# EAGLE design 229_pedometer (EAGLE 9.6.2)
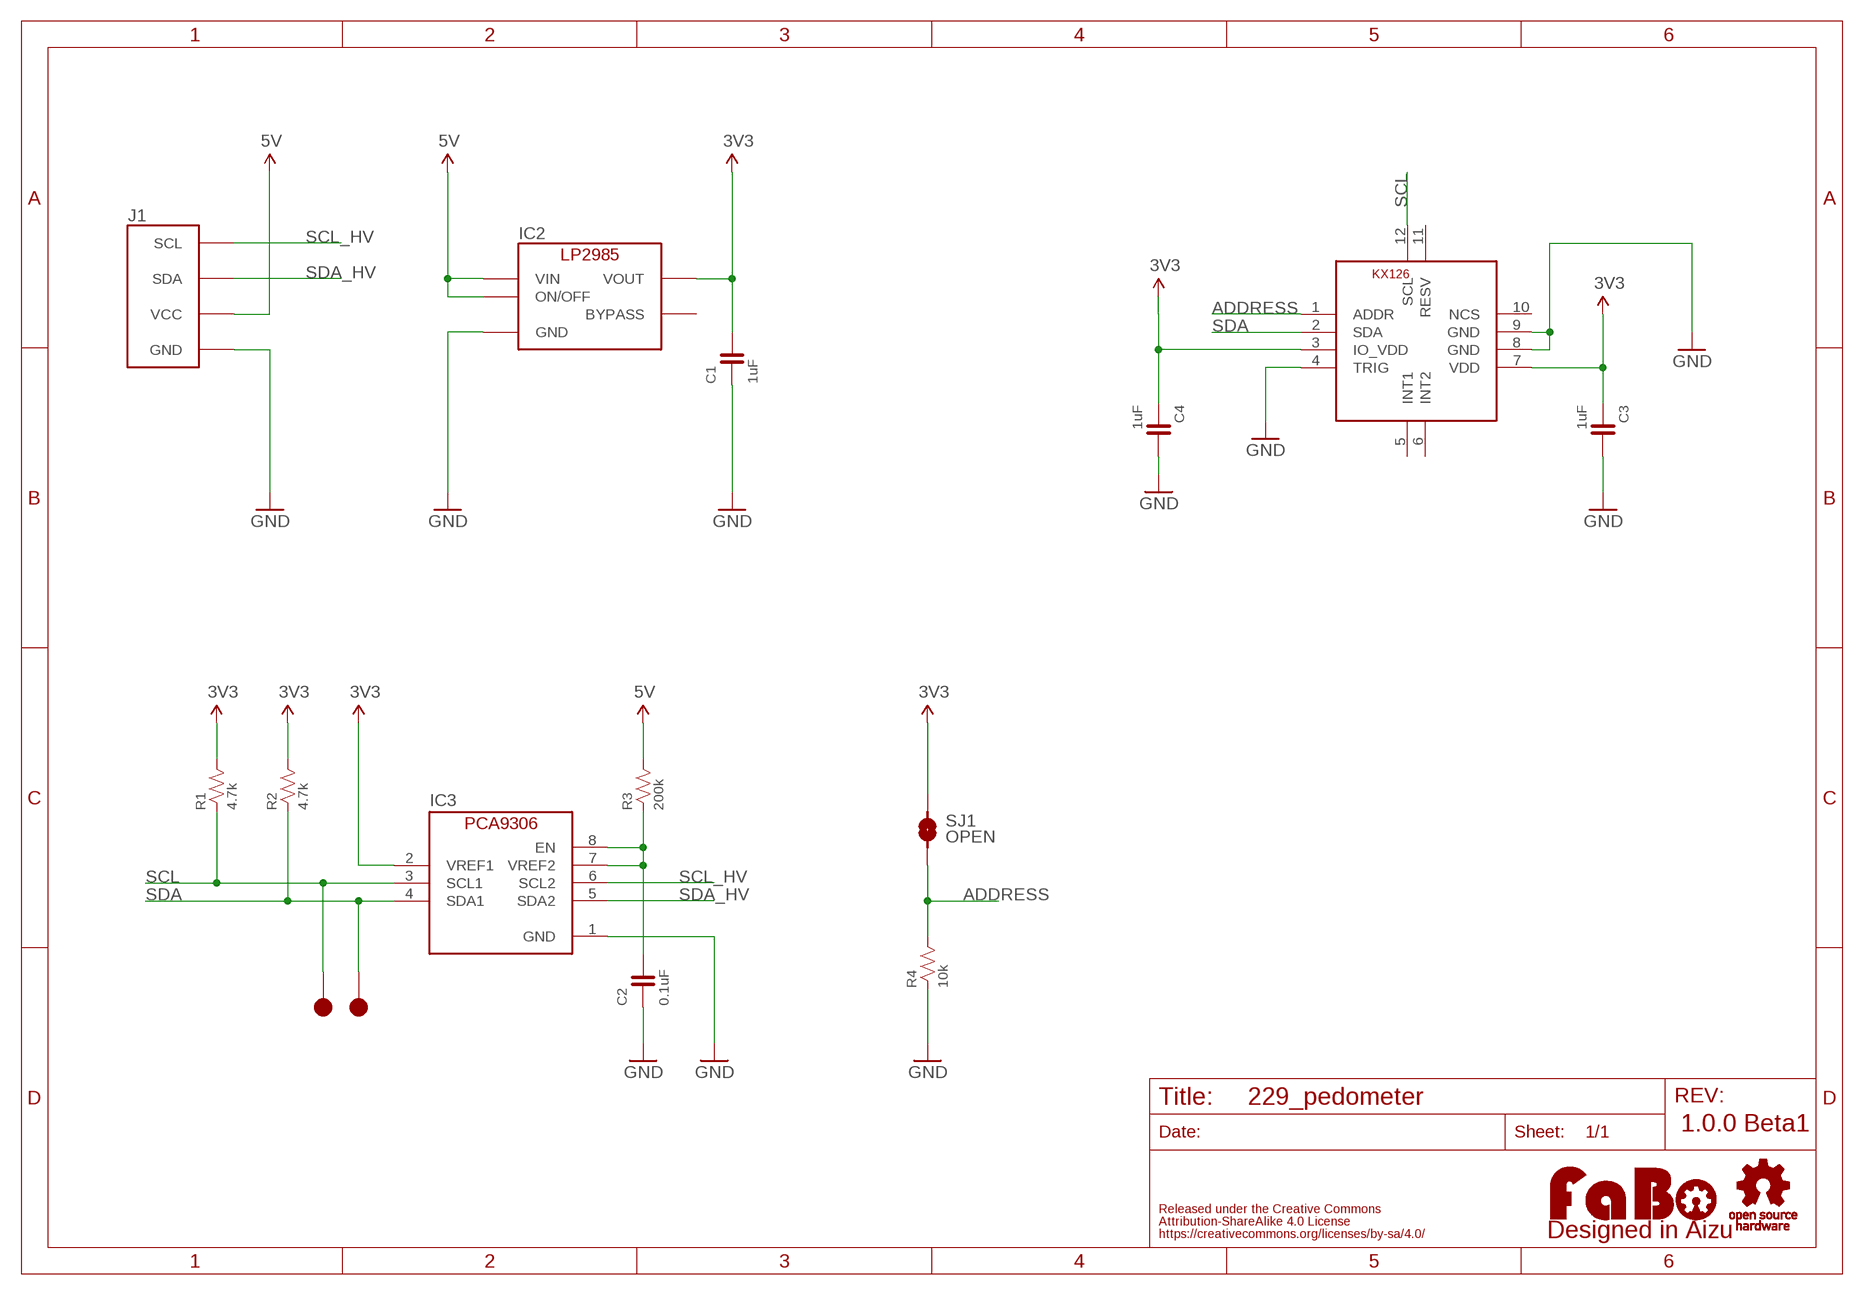
[diagram p0: schematic, sheet 1]

## Parts
C1  1uF  CAPACITOR-0603  [0603]
C2  0.1uF  CAPACITOR-0603  [0603]
C3  1uF  CAPACITOR-0603  [0603]
C4  1uF  CAPACITOR-0603  [0603]
IC2  LP2985-33DBV  [SOT-23-5]
IC3  PCA9306GM  [XQFN8]
J1  FABO_BRICK_I2C  [FABO_BRICK_I2C]
LOGO1  LOGO_FABO-M  [LOGO_FABO_M]
R1  4.7k  RESISTOR-0603  [0603]
R2  4.7k  RESISTOR-0603  [0603]
R3  200k  RESISTOR-0603  [0603]
R4  10k  RESISTOR-0603  [0603]
SJ1  OPEN  SMD-JUMPER-2  [SMD-JUMPER-2]
TP1  TP-15  [TP-15]
TP2  TP-15  [TP-15]
U$2  LOGO_OSHW-M_BOTTOM  [LOGO_OSHW_M_BOTTOM]
U$4  KX-KX126  [KIONIX-KX126]

## Nets
3V3: C1.2 C3.1 C4.1 IC2.5(VOUT) IC3.2(VREF1) R1.2 R2.2 SJ1.1 U$4.3(IO_VDD) U$4.7(VDD)
5V: IC2.1(VIN) IC2.3(ON/OFF) J1.VCC R3.2
ADDRESS: R4.2 SJ1.2 U$4.1(ADDR)
GND: C1.1 C2.1 C3.2 C4.2 IC2.2(GND) IC3.1(GND) J1.GND R4.1 U$4.4(TRIG) U$4.8(GND) U$4.9(GND)
N$1: C2.2 IC3.7(VREF2) IC3.8(EN) R3.1
SCL: IC3.3(SCL1) R1.1 TP2.1 U$4.12(SCL)
SCL_HV: IC3.6(SCL2) J1.SCL
SDA: IC3.4(SDA1) R2.1 TP1.1 U$4.2(SDA)
SDA_HV: IC3.5(SDA2) J1.SDA
Unconnected: IC2.4(BYPASS) U$4.5(INT1) U$4.6(INT2) U$4.10(NCS) U$4.11(RESV)

## Notes on the sheet
- 1.0.0 Beta1

## Library data of the parts
C1-C4 = FaBo-Capacitor:CAPACITOR: CAPACITOR
IC2 = FaBo-Supply:LP2985: LP2985
IC3 = FaBo-LevelTranslator:PCA9306
J1 = FaBo-Template:FABO_BRICK_I2C: FaBo Brick I2C
LOGO1 = component:LOGO_FABO
R1-R4 = FaBo-Resistors:RESISTOR: RESISTOR
SJ1 = FaBo-etc:SMD-JUMPER-2
TP1 TP2 = FaBo-Supply:TP
U$2 = FaBo-etc:LOGO_OSHW
U$4 = FaBo-Mems:KX-KX126

## Board
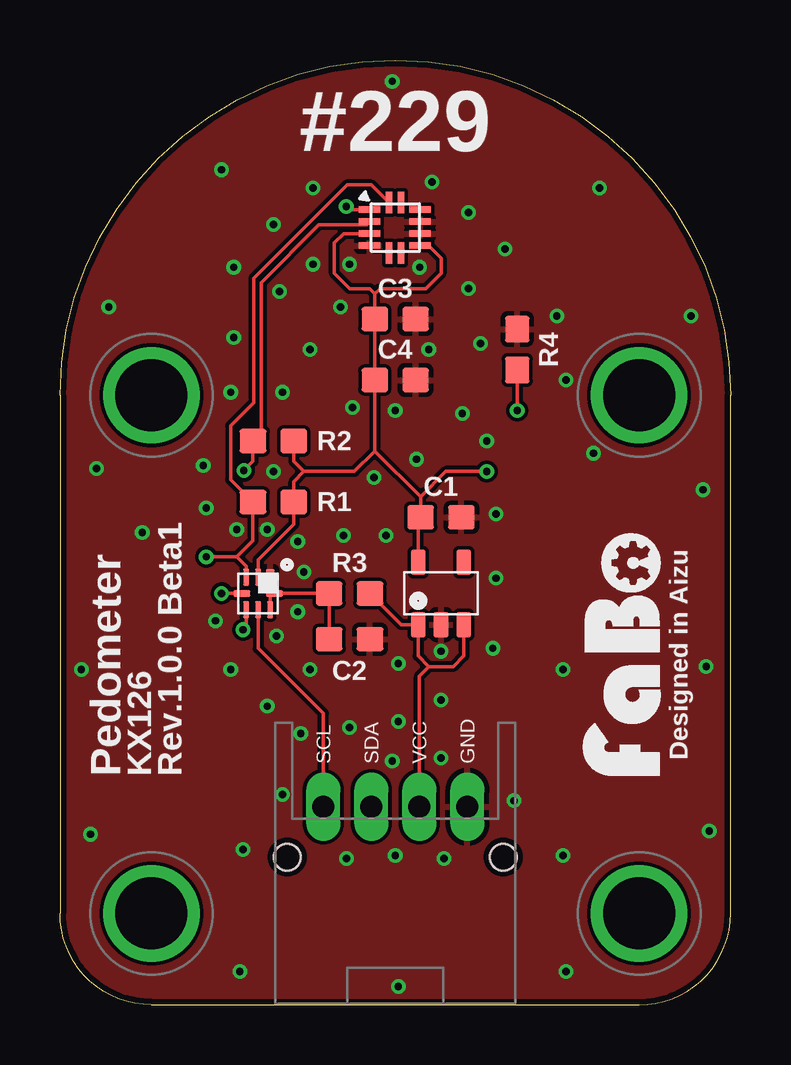
[diagram p1: board, top side]
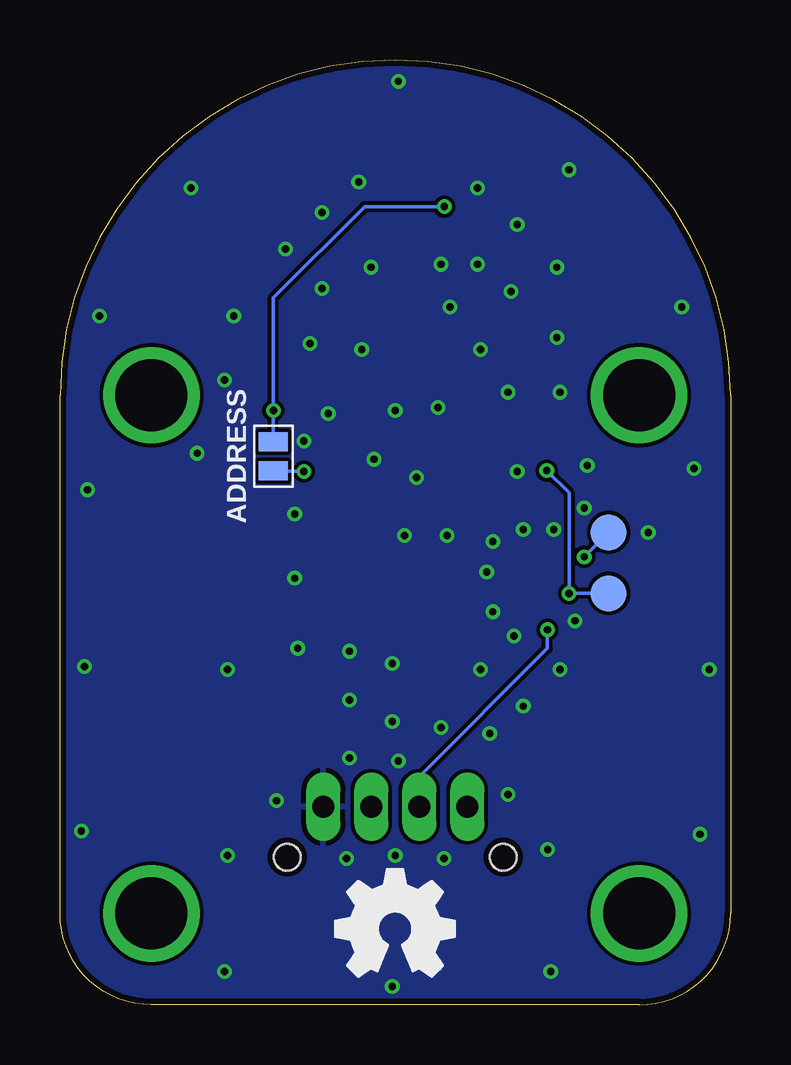
[diagram p2: board, bottom side, seen from below]

Size 27.94 x 39.37 mm. Coordinates in mm from the lower left corner, seen from the top.
Copper layers (1*16): Top 0.035mm / dielectric 1.6mm / Bottom 0.035mm
Design rules "PCBway": minimum track width 6mil, minimum drill 12mil, track to track 6mil, track to pad 6mil, pad to pad 6mil, via to via 6mil, smd to smd 6mil, copper to edge 10mil, drill to drill 10mil, minimum pad ring 10mil, minimum via ring 6mil, stop-mask expansion 2mil, vias tented up to drill 100mil, thermal gap 8mil

### Footprints (pad centres in the part's own frame; a part is rotated, then mirrored left to right if it is on the bottom)
0603 = smd 1.1 x 1: 1 -0.85,0; 2 0.85,0
SOT-23-5 = smd 0.6 x 1.05: 1 -0.95,-1.3; 2 0,-1.3; 3 0.95,-1.3; 4 0.95,1.3; 5 -0.95,1.3
XQFN8 = smd 0.7 x 0.35: 1 -0.675,0.5 | smd 0.7 x 0.25: 2 -0.675,0; 3 -0.675,-0.5; 5 0.675,-0.5; 6 0.675,0; 7 0.675,0.5 | smd 0.25 x 0.7: 4 0,-0.675; 8 0,0.675
FABO_BRICK_I2C = drill 0.9 pad 1.422 long: GND 3,-10.795; SCL -3,-10.795; SDA -1,-10.795; VCC 1,-10.795 | drill 3 pad 3.81: P$1 -10.16,6.35; P$2 10.16,6.35; P$3 -10.16,-15.24; P$4 10.16,-15.24 | hole 1.1: -4.5,-12.895; 4.5,-12.895
SMD-JUMPER-2 = smd 0.8 x 1.2: 1 -0.6,0; 2 0.6,0
TP-15 = smd 1.5 x 1.5: 1 0,0
KIONIX-KX126 = smd 0.9 x 0.27: 1 -1.07,0.75; 2 -1.07,0.25; 3 -1.07,-0.25; 4 -1.07,-0.75; 7 1.03,-0.75; 8 1.03,-0.25; 9 1.03,0.25; 10 1.03,0.75 | smd 0.27 x 0.9: 5 -0.27,-1.05; 6 0.23,-1.05; 11 0.23,1.05; 12 -0.27,1.05

### Placement (x,y rotation side)
C1  15.88,20.32 180 top
C2  12.06,15.24 180 top
C3  13.97,28.57 0 top
C4  13.97,26.04 0 top
IC2  15.88,17.14 0 top
IC3  8.26,17.14 270 top
J1  13.97,19.05 0 top
LOGO1  25.4,14.61 90 top
R1  8.89,20.95 0 top
R2  8.89,23.5 0 top
R3  12.06,17.14 0 top
R4  19.05,27.3 270 top
SJ1  19.05,22.86 90 bottom
TP1  5.08,17.14 0 bottom
TP2  5.08,19.68 0 bottom
U$2  13.97,3.17 0 top
U$4  13.97,32.38 0 top

### Tracks (layer width: path | path; a pad name or v marks a point on that pad's centre or on a via)
3V3  (via drill 0.3)
  Top 0.152: IC2.5 14.93,20.22 C1.2 15.03,21.17 | 13.12,23.07 C4.1 C3.1 13.12,29.63 | 13.12,23.07 15.03,21.17 | v17.78,22.23 16.08,22.23 15.03,21.17 | 10.16,22.23 12.27,22.23 13.12,23.07 | 13.12,29.63 13.34,29.84 15.24,29.84 15.88,30.48 15.88,31.11 15.36,31.64 U$4.7 | U$4.3 11.81,32.13 11.43,31.75 11.43,30.48 12.06,29.84 12.9,29.84 13.12,29.63 | R2.2 9.74,22.64 10.16,22.23 | 10.16,22.23 9.74,21.8 R1.2 9.74,20.03 8.26,18.54 IC3.2
  Bottom 0.152: SJ1.1 19.02,22.23 v17.78,22.23
5V
  Top 0.152: 15.37,14.1 14.93,14.54 IC2.1 14.21,15.85 R3.2 | IC2.3 16.82,14.54 16.38,14.1 15.37,14.1 | J1.VCC 14.97,13.7 15.37,14.1
ADDRESS  (via drill 0.3)
  Top 0.152: R4.2 v19.05,24.77 | U$4.1 12.05,33.13 v11.93,33.26
  Bottom 0.152: SJ1.2 v19.05,24.77 19.05,29.46 15.25,33.26 v11.93,33.26
GND  (via drill 0.3)
  other vias: 10.54,30.86 12.06,30.86 8.89,22.23 8.64,19.81 7.37,19.81 6.1,20.7 9.91,19.3 10.16,18.03 13.08,21.97 13.59,19.56 9.91,16.38 9.02,15.37 6.48,16 3.43,19.68 5.97,22.48 7.11,25.53 9.27,25.53 12.19,24.89 13.97,24.77 14.86,22.73 17.78,23.5 18.16,20.45 18.16,17.78 18.03,14.86 15.88,14.73 14.1,14.22 11.81,19.56 14.1,11.81 15.88,12.7 15.88,10.29 13.84,10.16 12.06,11.56 10.03,11.3 9.27,8.76 18.92,8.51 11.94,6.1 16,6.1 13.97,6.22 7.11,13.97 8.64,12.45 10.41,13.97 9.14,29.72 7.24,30.73 8.89,32.51 10.54,34.04 14.99,30.73 11.68,29.08 10.41,27.3 15.37,27.3 17.02,29.84 16.76,24.64 17.53,27.56 18.54,31.5 15.49,34.29 17.02,33.02 20.7,28.7 21.08,26.04 22.23,22.99 7.24,27.81 7.62,6.48 20.95,6.22 21.08,1.4 7.49,1.4 14.1,0.76 27.05,7.24 1.27,7.11 26.8,21.46 26.92,14.1 20.95,13.97 0.89,13.97 1.52,22.35 26.29,28.7 2.03,29.08 6.73,34.8 22.48,34.04 13.84,38.48
  pour Top (isolate 0.152): 0,0 27.94,0 27.94,39.37 0,39.37
  pour Bottom (isolate 0.152): 0,0 27.94,0 27.94,39.37 0,39.37
N$1
  Top 0.152: C2.2 R3.1 IC3.8 8.76,17.14 IC3.7
SCL  (via drill 0.3)
  Top 0.152: U$4.12 12.97,34.16 11.96,34.16 8.08,30.28 8.08,25.09 7.11,24.13 7.11,21.88 R1.1 8.04,19.34 7.37,18.67 | 7.37,18.67 v6.1,18.67 | IC3.3 7.75,18.28 7.37,18.67
  Bottom 0.152: TP2.1 v6.1,18.67
SCL_HV
  Top 0.152: IC3.6 8.26,14.86 10.97,12.14 J1.SCL
SDA  (via drill 0.3)
  Top 0.152: U$4.2 12.77,32.51 10.79,32.51 8.38,30.1 8.38,23.84 R2.1 8.04,22.64 v7.66,22.26 | IC3.4 v6.73,17.14
  Bottom 0.152: TP1.1 v6.73,17.14 6.73,21.34 v7.66,22.26
SDA_HV  (via drill 0.3)
  Top 0.152: IC3.5 7.75,15.76 v7.63,15.63
  Bottom 0.152: v7.63,15.63 7.63,14.85 12.97,9.51 J1.SDA

### Text on the board
tPlace: #229 | Designed in Aizu | Pedometer | KX126 | Rev.1.0.0 Beta1
bPlace: ADDRESS